# Altium schematic sheet proj_arhipov_uart_rs232.SchDoc: =title_line_1 + title_line_2
size 420 x 297 mm; SheetNumber: 3
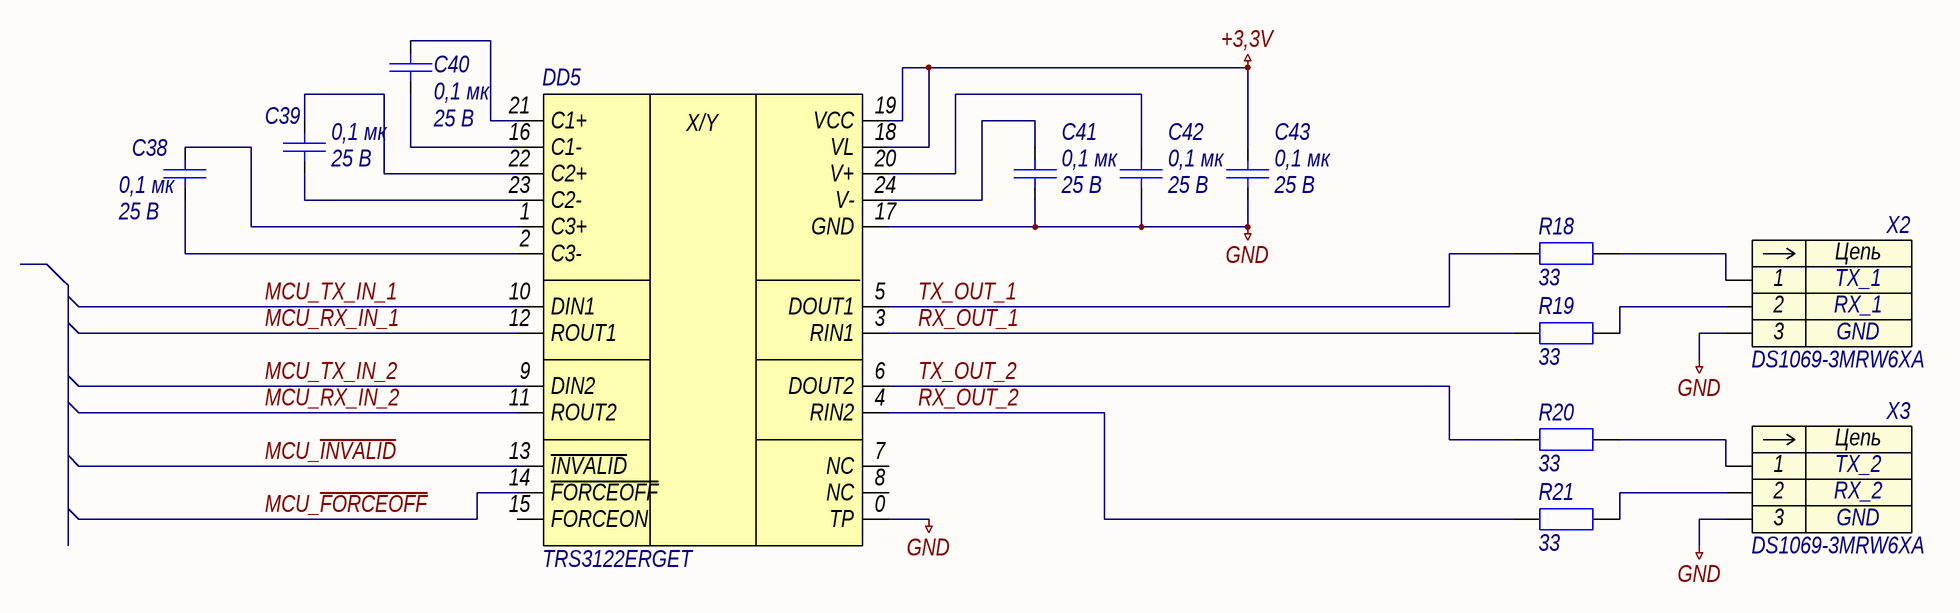
[diagram p0: proj_arhipov_uart_rs232.SchDoc]

## Parts
C38  0,1 мк  Напряжение: 25 В  [C0603]
C39  0,1 мк  Напряжение: 25 В  [C0603]
C40  0,1 мк  Напряжение: 25 В  [C0603]
C41  0,1 мк  Напряжение: 25 В  [C0603]
C42  0,1 мк  Напряжение: 25 В  [C0603]
C43  0,1 мк  Напряжение: 25 В  [C0603]
DD5  TRS3122ERGET  [QFN-24-400X400X80]
R18  33  [R0603]
R19  33  [R0603]
R20  33  [R0603]
R21  33  [R0603]
X2  DS1069-3MRW6XA  [DS1069-3MRW6XA]
X3  DS1069-3MRW6XA  [DS1069-3MRW6XA]

## Nets
+3,3V: C43.2 DD5.18(VL) DD5.19(VCC)
GND: C41.1 C42.1 C43.1 DD5.0(TP) DD5.17(GND) X2.3 X3.3
MCU_~{FORCEOFF}: DD5.14(~{FORCEOFF})
MCU_~{INVALID}: DD5.13(~{INVALID})
MCU_RX_IN_1: DD5.12(ROUT1)
MCU_RX_IN_2: DD5.11(ROUT2)
MCU_TX_IN_1: DD5.10(DIN1)
MCU_TX_IN_2: DD5.9(DIN2)
RX_OUT_1: DD5.3(RIN1) R19.1
RX_OUT_2: DD5.4(RIN2) R21.1
TX_OUT_1: DD5.5(DOUT1) R18.1
TX_OUT_2: DD5.6(DOUT2) R20.1
NetC38_1: C38.1 DD5.2(C3-)
NetC38_2: C38.2 DD5.1(C3+)
NetC39_1: C39.1 DD5.23(C2-)
NetC39_2: C39.2 DD5.22(C2+)
NetC40_1: C40.1 DD5.21(C1+)
NetC40_2: C40.2 DD5.16(C1-)
NetC41_2: C41.2 DD5.24(V-)
NetC42_2: C42.2 DD5.20(V+)
NetR18_2: R18.2 X2.1
NetR19_2: R19.2 X2.2
NetR20_2: R20.2 X3.1
NetR21_2: R21.2 X3.2

Not connected (* = marked no-connect by the designer): DD5 7(NC) 8(NC) 15(FORCEON)

## Notes on the sheet
- Подп. и дата
- Инв. № дубл.
- Взам. инв. №
- Инв. № подл.
- Лист
- Изм.
- № докум.
- Подп.
- Дата
- Копировал
- Формат
- А3
- (in symbol dd0018) X/Y
- (in symbol x0023) Цепь

## Library data of the parts
C38-C43 = c0058: =Описание; ID: c0058; Фамилия: Паньков; Описание: Конденсатор керамический чип 0603 100 нФ 25 В ±10 %; Наименование: CC0603KRX7R8BB104; Производитель: YAGEO Corp.; Отклонение: ±10 %; Рабочие температуры: от –55 °С до +125 °С; Температурный коэффициент емкости: X7R; Корпус: 0603; Номинал: 0,1 мк; Номинальное напряжение: 25 В; HelpURL: https://www.yageo.com/upload/media/product/productsearch/datasheet/mlcc/UPY-GPHC_X7R_6.3V-to-50V_20.pdf
DD5 = dd0018: =Описание; ID: dd0018; Фамилия: Жернаков; Описание: Приемопередатчик RS-232; Производитель: Texas Instruments; Корпус: QFN-24; Наименование: TRS3122ERGET; HelpURL: https://www.ti.com/product/TRS3122E
R18-R21 = r0006: =Описание; ID: r0006; Фамилия: Жернаков; Описание: Резистор 33 Ом; Наименование: RC0603F330CS; Производитель: Samsung; Отклонение: ±1 %; Номинальное напряжение: 25 В; Рабочие температуры: от -55 °С до +150 °С; Номинальный ток: 0,5 А; Корпус: 0603; Номинал: 33; HelpURL: http://product.samsungsem.com/cr/RC0603F330CS.do
X2 = x0023: =Описание; Contact_1: TX_1; Contact_2: RX_1; Contact_3: GND; ID: x0023; Фамилия: Паньков; Описание: CWF 3 pin Type A 2,5 мм вилка угловой; Производитель: Connfly Electronic Co., Ltd.; Наименование: DS1069-3MRW6XA; HelpURL: http://en.connfly.group/product/xVkr=EusQssAN0gN=Aos=mU+UrVkR9kqEAN0gN0MUR+g+NB+A
X3 = x0023: =Описание; Contact_1: TX_2; Contact_2: RX_2; Contact_3: GND; ID: x0023; Фамилия: Паньков; Описание: CWF 3 pin Type A 2,5 мм вилка угловой; Производитель: Connfly Electronic Co., Ltd.; Наименование: DS1069-3MRW6XA; HelpURL: http://en.connfly.group/product/xVkr=EusQssAN0gN=Aos=mU+UrVkR9kqEAN0gN0MUR+g+NB+A